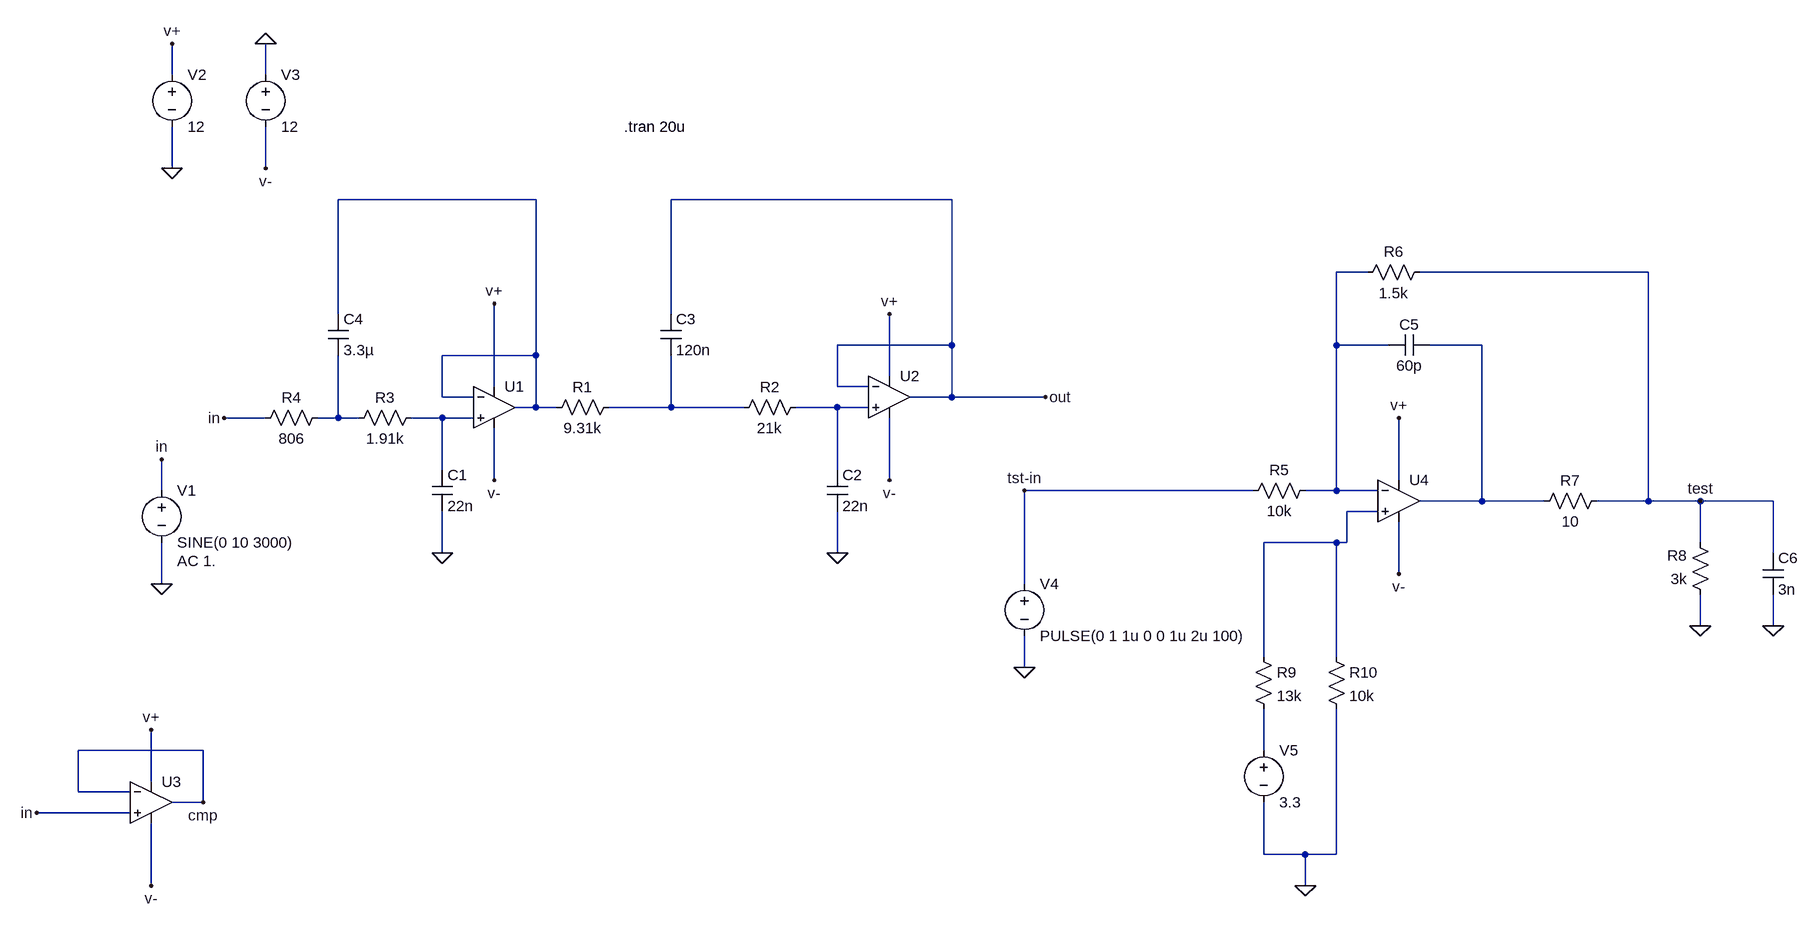
[diagram p0: schematic adc-low-pass-filter.asc]
adc-low-pass-filter.asc, the LTspice schematic file:
Version 4
SHEET 1 1076 1108
WIRE -1520 -848 -1520 -896
WIRE -1376 -848 -1376 -896
WIRE -1520 -704 -1520 -768
WIRE -1376 -704 -1376 -768
WIRE -960 -656 -1264 -656
WIRE -320 -656 -752 -656
WIRE 320 -544 272 -544
WIRE 752 -544 400 -544
WIRE -1264 -480 -1264 -656
WIRE -752 -480 -752 -656
WIRE -320 -432 -320 -656
WIRE -320 -432 -496 -432
WIRE 272 -432 272 -544
WIRE 352 -432 272 -432
WIRE 496 -432 416 -432
WIRE -960 -416 -960 -656
WIRE -960 -416 -1104 -416
WIRE -416 -384 -416 -480
WIRE -1024 -368 -1024 -496
WIRE -496 -368 -496 -432
WIRE -448 -368 -496 -368
WIRE -1104 -352 -1104 -416
WIRE -1056 -352 -1104 -352
WIRE -320 -352 -320 -432
WIRE -320 -352 -384 -352
WIRE -176 -352 -320 -352
WIRE -960 -336 -960 -416
WIRE -960 -336 -992 -336
WIRE -928 -336 -960 -336
WIRE -752 -336 -752 -416
WIRE -752 -336 -848 -336
WIRE -640 -336 -752 -336
WIRE -496 -336 -560 -336
WIRE -448 -336 -496 -336
WIRE -1376 -320 -1440 -320
WIRE -1264 -320 -1264 -416
WIRE -1264 -320 -1296 -320
WIRE -1232 -320 -1264 -320
WIRE -1104 -320 -1152 -320
WIRE -1056 -320 -1104 -320
WIRE -1104 -240 -1104 -320
WIRE -496 -240 -496 -336
WIRE -1024 -224 -1024 -304
WIRE -416 -224 -416 -320
WIRE 368 -224 368 -320
WIRE -1536 -208 -1536 -256
WIRE 144 -208 -208 -208
WIRE 272 -208 272 -432
WIRE 272 -208 224 -208
WIRE 336 -208 272 -208
WIRE 496 -192 496 -432
WIRE 496 -192 400 -192
WIRE 592 -192 496 -192
WIRE 752 -192 752 -544
WIRE 752 -192 672 -192
WIRE 832 -192 752 -192
WIRE 944 -192 832 -192
WIRE 336 -176 288 -176
WIRE 272 -128 160 -128
WIRE 288 -128 288 -176
WIRE 288 -128 272 -128
WIRE 832 -128 832 -192
WIRE -1104 -112 -1104 -176
WIRE -496 -112 -496 -176
WIRE 944 -112 944 -192
WIRE 368 -80 368 -160
WIRE -1536 -64 -1536 -128
WIRE -208 -64 -208 -208
WIRE 832 0 832 -48
WIRE 944 0 944 -48
WIRE 160 48 160 -128
WIRE 272 48 272 -128
WIRE -208 64 -208 16
WIRE -1472 192 -1664 192
WIRE 160 192 160 128
WIRE -1552 240 -1552 160
WIRE -1664 256 -1664 192
WIRE -1584 256 -1664 256
WIRE -1472 272 -1472 192
WIRE -1472 272 -1520 272
WIRE -1584 288 -1728 288
WIRE 160 352 160 272
WIRE 224 352 160 352
WIRE 272 352 272 128
WIRE 272 352 224 352
WIRE -1552 400 -1552 304
WIRE 224 400 224 352
FLAG -496 -112 0
FLAG -1104 -112 0
FLAG -176 -352 out
FLAG -1440 -320 in
FLAG -1536 -64 0
FLAG -1536 -256 in
FLAG -1520 -704 0
FLAG -1520 -896 v+
FLAG -1376 -704 v-
FLAG -1376 -896 0
FLAG -1024 -224 v-
FLAG -1728 288 in
FLAG -1552 160 v+
FLAG -1552 400 v-
FLAG -1472 272 cmp
FLAG -416 -224 v-
FLAG -1024 -496 v+
FLAG -416 -480 v+
FLAG 368 -320 v+
FLAG 368 -80 v-
FLAG -208 64 0
FLAG 832 0 0
FLAG 832 -192 test
FLAG 944 0 0
FLAG 224 400 0
FLAG -208 -208 tst-in
SYMBOL Opamps\\UniversalOpamp2 -1024 -336 R0
SYMATTR InstName U1
SYMBOL res -832 -352 R90
WINDOW 0 0 56 VBottom 2
WINDOW 3 32 56 VTop 2
SYMATTR InstName R1
SYMATTR Value 9.31k
SYMBOL res -544 -352 R90
WINDOW 0 0 56 VBottom 2
WINDOW 3 32 56 VTop 2
SYMATTR InstName R2
SYMATTR Value 21k
SYMBOL res -1136 -336 R90
WINDOW 0 0 56 VBottom 2
WINDOW 3 32 56 VTop 2
SYMATTR InstName R3
SYMATTR Value 1.91k
SYMBOL res -1280 -336 R90
WINDOW 0 0 56 VBottom 2
WINDOW 3 32 56 VTop 2
SYMATTR InstName R4
SYMATTR Value 806
SYMBOL cap -1120 -240 R0
SYMATTR InstName C1
SYMATTR Value 22n
SYMBOL cap -512 -240 R0
SYMATTR InstName C2
SYMATTR Value 22n
SYMBOL cap -768 -480 R0
SYMATTR InstName C3
SYMATTR Value 120n
SYMBOL cap -1280 -480 R0
SYMATTR InstName C4
SYMATTR Value 3.3µ
SYMBOL voltage -1536 -224 R0
WINDOW 123 24 124 Left 2
WINDOW 39 0 0 Left 2
SYMATTR Value2 AC 1.
SYMATTR InstName V1
SYMATTR Value SINE(0 10 3000)
SYMBOL voltage -1520 -864 R0
WINDOW 123 0 0 Left 2
WINDOW 39 0 0 Left 2
SYMATTR InstName V2
SYMATTR Value 12
SYMBOL voltage -1376 -864 R0
WINDOW 123 0 0 Left 2
WINDOW 39 0 0 Left 2
SYMATTR InstName V3
SYMATTR Value 12
SYMBOL Opamps\\UniversalOpamp2 -1552 272 R0
SYMATTR InstName U3
SYMBOL Opamps\\UniversalOpamp2 -416 -352 R0
SYMATTR InstName U2
SYMBOL Opamps\\UniversalOpamp2 368 -192 R0
SYMATTR InstName U4
SYMBOL voltage -208 -80 R0
WINDOW 123 0 0 Left 2
WINDOW 39 0 0 Left 2
SYMATTR InstName V4
SYMATTR Value PULSE(0 1 1u 0 0 1u 2u 100)
SYMBOL res 240 -224 R90
WINDOW 0 0 56 VBottom 2
WINDOW 3 32 56 VTop 2
SYMATTR InstName R5
SYMATTR Value 10k
SYMBOL res 416 -560 R90
WINDOW 0 0 56 VBottom 2
WINDOW 3 32 56 VTop 2
SYMATTR InstName R6
SYMATTR Value 1.5k
SYMBOL res 688 -208 R90
WINDOW 0 0 56 VBottom 2
WINDOW 3 32 56 VTop 2
SYMATTR InstName R7
SYMATTR Value 10
SYMBOL res 848 -32 R180
WINDOW 0 36 76 Left 2
WINDOW 3 36 40 Left 2
SYMATTR InstName R8
SYMATTR Value 3k
SYMBOL cap 416 -448 R90
WINDOW 0 0 32 VBottom 2
WINDOW 3 32 32 VTop 2
SYMATTR InstName C5
SYMATTR Value 60p
SYMBOL cap 928 -112 R0
SYMATTR InstName C6
SYMATTR Value 3n
SYMBOL voltage 160 176 R0
WINDOW 123 0 0 Left 2
WINDOW 39 0 0 Left 2
SYMATTR InstName V5
SYMATTR Value 3.3
SYMBOL res 144 32 R0
SYMATTR InstName R9
SYMATTR Value 13k
SYMBOL res 256 32 R0
SYMATTR InstName R10
SYMATTR Value 10k
TEXT -824 -768 Left 2 !.tran 20u

The netlist it stands for:
* adc-low-pass-filter.asc
XU1 N007 N001 v+ v- N001 level.2 Avol=1Meg GBW=10Meg Slew=10Meg ilimit=25m rail=0 Vos=0 phimargin=45 en=0 enk=0 in=0 ink=0 Rin=500Meg  ; pins IN+ IN- V+ V- OUT
R1 N004 N001 9.31k
R2 N005 N004 21k
R3 N007 N006 1.91k
R4 N006 in 806
C1 N007 0 22n
C2 N005 0 22n
C3 out N004 120n
C4 N001 N006 3.3µ
V1 in 0 SINE(0 10 3000) AC 1.
V2 v+ 0 12
V3 0 v- 12
XU3 in cmp v+ v- cmp level.2 Avol=1Meg GBW=10Meg Slew=10Meg ilimit=25m rail=0 Vos=0 phimargin=45 en=0 enk=0 in=0 ink=0 Rin=500Meg  ; pins IN+ IN- V+ V- OUT
XU2 N005 out v+ v- out level.2 Avol=1Meg GBW=10Meg Slew=10Meg ilimit=25m rail=0 Vos=0 phimargin=45 en=0 enk=0 in=0 ink=0 Rin=500Meg  ; pins IN+ IN- V+ V- OUT
XU4 N008 N002 v+ v- N003 level.2 Avol=1Meg GBW=10Meg Slew=10Meg ilimit=25m rail=0 Vos=0 phimargin=45 en=0 enk=0 in=0 ink=0 Rin=500Meg  ; pins IN+ IN- V+ V- OUT
V4 tst-in 0 PULSE(0 1 1u 0 0 1u 2u 100)
R5 N002 tst-in 10k
R6 test N002 1.5k
R7 test N003 10
R8 0 test 3k
C5 N003 N002 60p
C6 test 0 3n
V5 N009 0 3.3
R9 N008 N009 13k
R10 N008 0 10k
.tran 20u
.lib UniversalOpamps2.sub
.backanno
.end